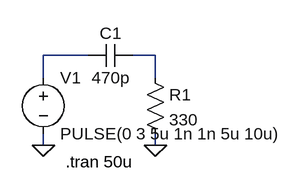
[diagram p0: schematic Draft1.asc]
Draft1.asc, the LTspice schematic file:
Version 4
SHEET 1 880 680
WIRE 160 64 96 64
WIRE 256 64 224 64
WIRE 96 96 96 64
WIRE 256 96 256 64
WIRE 96 192 96 176
WIRE 256 192 256 176
FLAG 96 192 0
FLAG 256 192 0
SYMBOL voltage 96 80 R0
WINDOW 123 0 0 Left 0
WINDOW 39 0 0 Left 0
SYMATTR InstName V1
SYMATTR Value PULSE(0 3 5u 1n 1n 5u 10u)
SYMBOL cap 224 48 R90
WINDOW 0 0 32 VBottom 2
WINDOW 3 32 32 VTop 2
SYMATTR InstName C1
SYMATTR Value 470p
SYMBOL res 240 80 R0
SYMATTR InstName R1
SYMATTR Value 330
TEXT 128 216 Left 2 !.tran 50u

The netlist it stands for:
* Draft1.asc
V1 N001 0 PULSE(0 3 5u 1n 1n 5u 10u)
C1 N002 N001 470p
R1 N002 0 330
.tran 50u
.backanno
.end